# EAGLE design encoder8 (EAGLE 8.2.2)
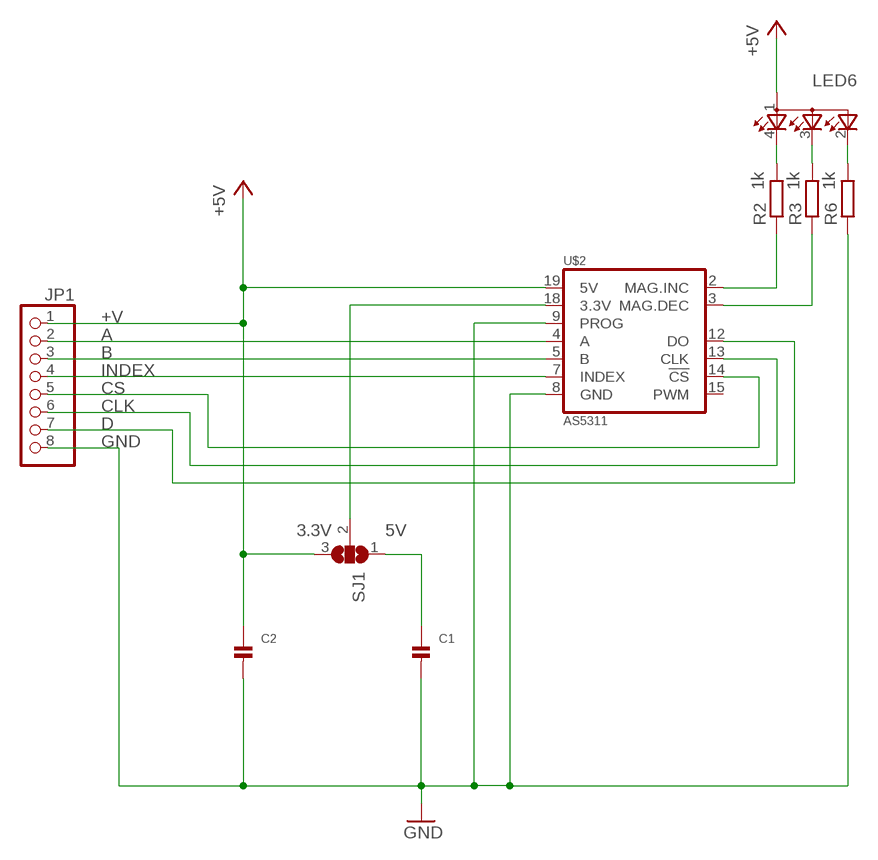
[diagram p0: schematic, sheet 1]

## Parts
C1  CAP_CERAMIC0805  [0805]
C2  CAP_CERAMIC0805  [0805]
JP1  PINHD-1X8BIG  [1X08-BIG]
LED6  RGB  RGB_LED_0805  [RGB_LED_0805]
R2  1k  R-EU_M0805  [M0805]
R3  1k  R-EU_M0805  [M0805]
R6  1k  R-EU_M0805  [M0805]
SJ1  SJ2W  [SJ_2]
U$2  AS5311  [TSSOP.20]

## Nets
+5V: LED6.1(CA)
+V: C2.1 JP1.1 SJ1.3 U$2.19(5V) ; supply symbol labelled +5V
A: JP1.2 U$2.4(A)
B: JP1.3 U$2.5(B)
CLK: JP1.6 U$2.13(CLK)
CS: JP1.5 U$2.14(!CS)
D: JP1.7 U$2.12(DO)
DEC: R3.1 U$2.3(MAG.DEC)
GND: C1.2 C2.2 JP1.8 R6.1 U$2.8(GND) U$2.9(PROG)
INC: R2.1 U$2.2(MAG.INC)
INDEX: JP1.4 U$2.7(INDEX)
N$2: C1.1 SJ1.1
N$3: LED6.4(CRED) R2.2
N$4: LED6.3(CGREEN) R3.2
N$5: LED6.2(CBLUE) R6.2
N$8: SJ1.2 U$2.18(3.3V)
Unconnected: U$2.15(PWM)

## Notes on the sheet
- 3.3V | 5V

## Library data of the parts
C1 C2 = microbuilder:CAP_CERAMIC: Ceramic Capacitors 0402 - 0402 Surface Mount Capacitors 16pF 50V 5% [Digikey: 445-4899-2-ND] 18pF 50V 5% [Digikey: 490-1281-2-ND] 22pF 50V 5% [Digikey: 490-1283-2-ND] 68pF 50V 5% [Digikey: 490-1289-2-ND] 0.1uF 10V 10% [Digikey: 490-1318-2-ND] 1.0uF 6.3V 10% [Digikey: 490-1320-2-ND] 0603 - 0603 Surface Mount Capacitors 16 pF 50V 5% [Digikey: 445-5051-2-ND] 22 pF 50V [Digikey: PCC220ACVTR-ND] 33 pF 50V 5% [Digikey: 490-1415-1-ND] 56pF 50V 5% [Digikey: 490-1421-1-ND] 220pF 50V 5% [Digikey: 445-1285-1-ND] 680 pF 50V 2200 pF 50V 5% C0G [Digikey: 445-1297-1-ND] 5600 pF 100V 5% X7R [Digikey: 478-3711-1-ND] 0.1 µF 25V 10% [Digikey: PCC2277TR-ND] 0.22 µF 16V 10% X7R [Digikey: 445-1318-1-ND] 1.0 µF 25V 10% [Digikey: 445-5146-2-ND] 0603 - RF Specific 3pF 250V +/-0.1pF RF [Digikey: 712-1347-1-ND] 18 pF 250V 5% [Digikey: 478-3505-1-ND or 712-1322-1-ND] 56 pF 250V 5% C0G RF [Digikey: 490-4867-1-ND] 68 pF 250V RF [Digikey: 490-4868-1-ND] 0805 - 0805 Surface Mount Capacitors 220 pF 250V 2% RF Ceramic Capacitor [Digikey: 712-1398-1-ND] 1000 pF 50V 2% NP0 Ceramic Capacitor [Digikey: 478-3760-1-ND] 0.1 µF 25V 10% Ceramic Capacitor [Digikey: PCC1828TR-ND] 1.0 µF 16V 10% Ceramic Capacitor[Digikey: 490-1691-2-ND] 10.0 µF 10V 10% Ceramic Capacitor[Digikey: 709-1228-1-ND] 10.0 uF 16V 10% Ceramic Capacitor [Digikey: 478-5165-2-ND] 47 uF 6.3V 20% Ceramic Capacitor [Digikey: 587-1779-1-ND or 399-5506-1-ND] 1206 - 1206 Surface Mount Capacitors 47uF 10V 20% Ceramic Capacitor [Digikey: 490-5528-1-ND or 399-5508-1-ND or 445-6010-1-ND] 100uF 6.3V -20%, +80% Y5V Ceramic Capacitor (Digikey: 490-4512-1-ND, Mouser: 81-GRM31CF50J107ZE1L)
JP1 = adafruit:PINHD-1X8: PIN HEADER
LED6 = Peters:RGB_LED_0805
R2 R3 R6 = resistor:R-EU_: RESISTOR, European symbol
SJ1 = jumper:SJ2W: SMD solder JUMPER
U$2 = AustrianMicro:AS5311

## Board
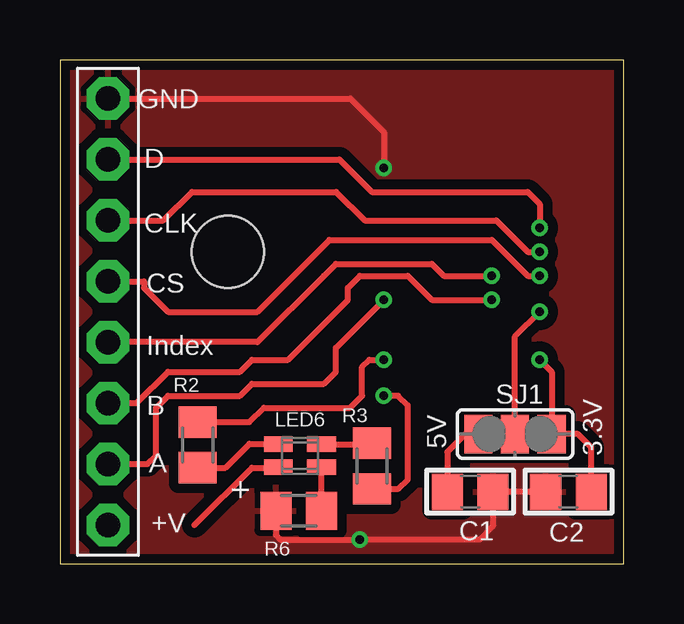
[diagram p1: board, top side]
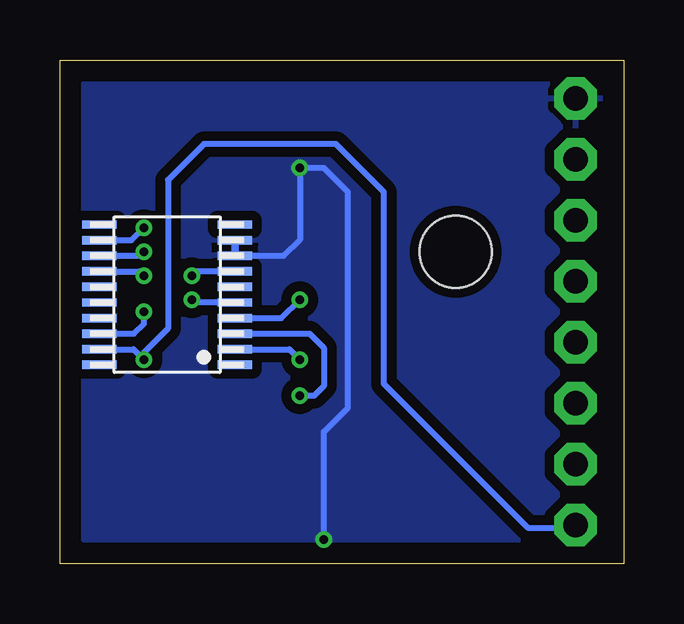
[diagram p2: board, bottom side, seen from below]

Size 23.5 x 21 mm. Coordinates in mm from the lower left corner, seen from the top.
Outline: 0,0 23.5,0 23.5,21 0,21 0,0
Copper layers (1*16): Top 0.0356mm / dielectric 1.5011mm / Bottom 0.0356mm
Design rules "oshpark-2layer": minimum track width 6mil, minimum drill 13mil, track to track 6mil, track to pad 6mil, pad to pad 6mil, via to via 6mil, smd to smd 6mil, copper to edge 15mil, drill to drill 6mil, minimum pad ring 7mil, minimum via ring 7mil, stop-mask expansion 2.5mil, vias tented up to drill 0mil, thermal gap 10mil
Holes 3 mm at 7,13

### Footprints (pad centres in the part's own frame; a part is rotated, then mirrored left to right if it is on the bottom)
0805 = smd 1.3 x 1.5: 1 -0.95,0; 2 0.95,0
1X08-BIG = drill 1.016 pad 1.778 octagon: 1 -8.89,0; 2 -6.35,0; 3 -3.81,0; 4 -1.27,0; 5 1.27,0; 6 3.81,0; 7 6.35,0; 8 8.89,0
RGB_LED_0805 = smd 0.65 x 1.2: 1 -0.475,0.9; 2 -0.475,-0.9; 3 0.475,-0.9; 4 0.475,0.9
M0805 = smd 1.3 x 1.6: 1 -0.95,0; 2 0.95,0
SJ_2 = smd 1.168 x 1.6: 1 -1.524,0; 2 0,0; 3 1.524,0
TSSOP.20 = smd 0.35 x 1.45: 1 -2.925,-2.825; 2 -2.275,-2.825; 3 -1.625,-2.825; 4 -0.975,-2.825; 5 -0.325,-2.825; 6 0.325,-2.825; 7 0.975,-2.825; 8 1.625,-2.825; 9 2.275,-2.825; 10 2.925,-2.825; 11 2.925,2.825; 12 2.275,2.825; 13 1.625,2.825; 14 0.975,2.825; 15 0.325,2.825; 16 -0.325,2.825; 17 -0.975,2.825; 18 -1.625,2.825; 19 -2.275,2.825; 20 -2.925,2.825

### Placement (x,y rotation side)
C1  17.1,3 0 top
C2  21.2,3 180 top
JP1  2,10.5 90 top
LED6  10,4.5 90 top
R2  5.74,4.95 270 top
R3  13.01,4.07 90 top
R6  9.96,2.2 0 top
SJ1  18.98,5.4 0 top
U$2  19.03,11.21 90 bottom

### Tracks (layer width: path | path; a pad name or v marks a point on that pad's centre or on a via)
+5V
  Top 0.254: LED6.1 9.07,4 8,4 5.61,1.61
+V  (via drill 0.35)
  Top 0.254: v20,8.5 20.5,8 SJ1.3 21.6,5.4 22.15,4.85 C2.1
  Bottom 0.254: U$2.19 20.43,8.94 v20,8.5 20,8.8 19,9.8 19,16 17.5,17.5 12,17.5 10,15.5 10,7.5 4,1.5 2.11,1.5 JP1.1
A  (via drill 0.35)
  Top 0.254: JP1.2 3.65,4.15 4,4.5 4,6.5 4.5,7 7.5,7 8,7.5 11,7.5 11.5,8 11.5,9 v13.5,11
  Bottom 0.254: U$2.4 14.27,10.23 v13.5,11
B  (via drill 0.35)
  Top 0.254: JP1.3 3.19,6.69 4.5,8 7.5,8 8,8.5 9.5,8.5 12,11 12,11.5 12.5,12 14.5,12 15.5,11 v18,11
  Bottom 0.254: U$2.5 17.89,10.88 v18,11
CLK  (via drill 0.35)
  Top 0.254: v20,13 19.5,13 18.19,14.31 12.71,14.31 11.52,15.5 5.5,15.5 4.31,14.31 JP1.6
  Bottom 0.254: U$2.13 20.16,12.84 v20,13
CS  (via drill 0.35)
  Top 0.254: JP1.5 3.5,11.77 3.5,11.5 4.5,10.5 8.23,10.5 11.23,13.5 18,13.5 19.5,12 v20,12
  Bottom 0.254: U$2.14 20.18,12.19 v20,12
D  (via drill 0.35)
  Top 0.254: JP1.7 11.65,16.85 13,15.5 19.5,15.5 20,15 v20,14
  Bottom 0.254: U$2.12 20.52,13.48 v20,14
DEC  (via drill 0.35)
  Top 0.254: R3.1 14.12,3.12 14.5,3.5 14.5,6.6 14.1,7 v13.5,7
  Bottom 0.254: U$2.3 13.09,9.59 12.5,9 12.5,7.4 12.9,7 v13.5,7
GND  (via drill 0.35)
  Top 0.254: R6.1 9.01,1.19 9.2,1 v12.5,1 17.5,1 18.05,1.55 C1.2 C2.2 | v13.5,16.5 13.5,18 12.11,19.39 JP1.8
  Bottom 0.254: U$2.8 14.16,12.84 13.5,13.5 13.5,16.41 | 13.5,16.41 v13.5,16.5 | v12.5,1 12.5,5.5 11.5,6.5 11.5,15.5 12.5,16.5 13.41,16.5 13.5,16.41
  Bottom 0.305: U$2.8 U$2.9
  pour Top (isolate 0.406): 0.5,0.5 23,0.5 23,20.5 0.5,20.5
  pour Bottom (isolate 0.406): 1,1 22.5,1 22.5,20 1,20
INC  (via drill 0.35)
  Top 0.254: R2.1 7.9,5.9 8.5,6.5 12.1,6.5 12.6,7 12.6,8.2 12.9,8.5 v13.5,8.5
  Bottom 0.254: U$2.2 13.94,8.94 v13.5,8.5
INDEX  (via drill 0.35)
  Top 0.254: JP1.4 8.23,9.23 11,11.99 11,12 11.5,12.5 15.5,12.5 16,12 v18,12
  Bottom 0.254: U$2.7 17.82,12.19 v18,12
N$2
  Top 0.254: C1.1 16.15,4.65 16.9,5.4 SJ1.1
N$3
  Top 0.254: R2.2 6.9,4 7.9,5 9.07,5 LED6.4
N$4
  Top 0.254: LED6.3 12.96,4.97 R3.2
N$5
  Top 0.254: R6.2 10.91,4.01 LED6.2
N$8  (via drill 0.35)
  Top 0.254: SJ1.2 18.98,9.48 v20,10.5
  Bottom 0.254: U$2.18 20.41,9.59 20,10 v20,10.5

### Text on the board
tNames: GND | D | CLK | CS | Index | B | 5V | A | + | 3.3V | +V